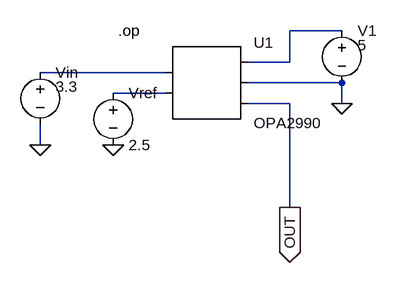
[diagram p0: schematic OPA2990 (8-PIN OP AMP).asc]
OPA2990 (8-PIN OP AMP).asc, the LTspice schematic file:
Version 4
SHEET 1 880 680
WIRE 624 240 544 240
WIRE 544 288 544 240
WIRE 544 288 480 288
WIRE 352 304 160 304
WIRE 624 320 480 320
WIRE 352 336 272 336
WIRE 544 352 480 352
WIRE 624 352 624 320
WIRE 160 416 160 384
WIRE 544 512 544 352
FLAG 160 416 0
FLAG 624 352 0
FLAG 272 416 0
FLAG 544 512 OUT
IOPIN 544 512 Out
SYMBOL AutoGenerated/OPA2990 416 320 R0
SYMATTR InstName U1
SYMBOL voltage 624 224 R0
WINDOW 3 24 38 Left 2
SYMATTR Value 5
SYMATTR InstName V1
SYMBOL voltage 160 288 R0
WINDOW 3 24 38 Left 2
SYMATTR InstName Vin
SYMATTR Value 3.3
SYMBOL voltage 272 320 R0
SYMATTR InstName Vref
SYMATTR Value 2.5
TEXT 280 240 Left 2 !.op

The netlist it stands for:
* OPA2990 (8-PIN OP AMP).asc
* U1: OPA2990 (symbol AutoGenerated/OPA2990 not available, pins judged from their places): pin1=N002 pin2=N003 pin3=N001 pin4=0 pin5=OUT
V1 N001 0 5
Vin N002 0 3.3
Vref N003 0 2.5
.op
.backanno
.end